# EAGLE design Addon-mapleCUx_HM-RFM69-RFM95-V10-016 (EAGLE 7.6.0)
MAPLE-CUx Large Version
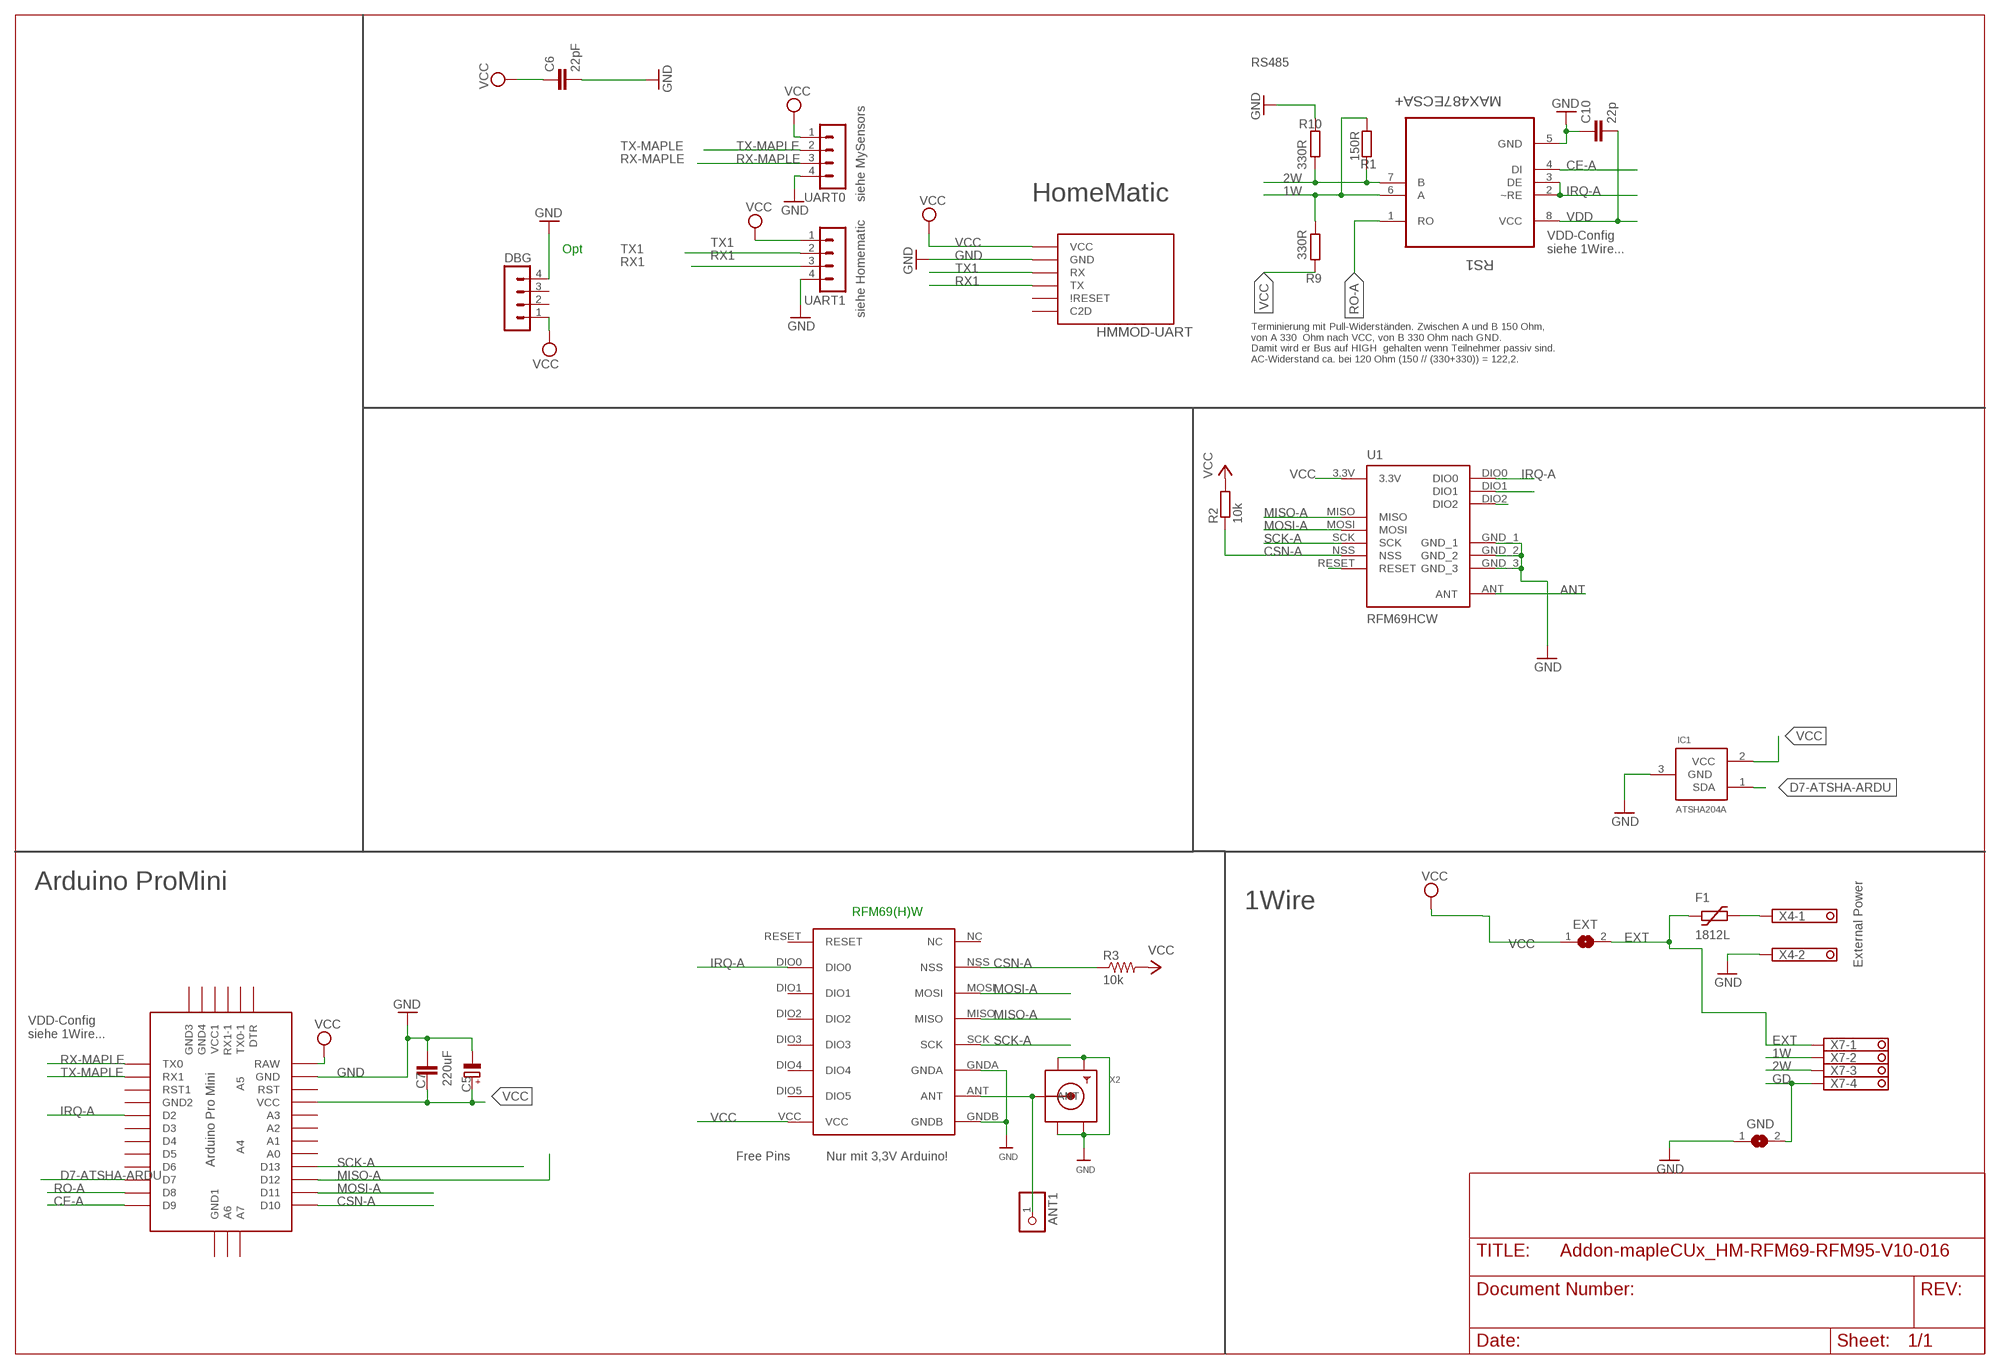
[diagram p0: schematic, sheet 1]

## Parts
ANT1  PINHD-1X1  [1X01]
C5  220uF  CPOL-EUE5-8.5  [E5-8,5]
C6  22pF  C-EUC0805  [C0805]
C7  C-EUC1812  [C1812]
C10  22p  C-EUC0805  [C0805]
DBG  MA04-1  [MA04-1]
EXT  SJ  [SJ]
F1  1812L  [1812L]
GND  SJ  [SJ]
HMMOD-UART  HM-MOD-UARTDIL  [HM-MOD-UART-DIL]
IC1  ATSHA204A  [SOT23]
R1  150R  R-EU_R0805  [R0805]
R2  10k  R-EU_M0805  [M0805]
R3  10k  RESISTOR0805-RES  [0805]
R9  330R  R-EU_R0805  [R0805]
R10  330R  R-EU_R0805  [R0805]
RFM69W  RFM69HW  [RFM]
RS1  MAX487ECSA+  [SOIC127P600X175-8N]
U1  RFM69HCW  [RFM69HCW-XXXS2]
U$2  ABK-PRO-MINI  [ABK-PRO-MINI]
UART0  MA04-1  [MA04-1]
UART1  MA04-1  [MA04-1]
X2  SMACONNECTOR_EDGE  [SMA_EDGELAUNCH]
X4  1751248  [1751248]
X7  1751264  [1751264]

## Nets
1W: R1.1 R9.2 RS1.6(A) X7.2
2W: R1.2 R10.1 RS1.7(B) X7.3
ANT: ANT1.1 RFM69W.ANT U1.ANT X2.P(ANT)
CE-A: RS1.4(DI) U$2.D9
CSN-A: R2.1 R3.1 RFM69W.NSS U1.NSS U$2.D10
D7-ATSHA-ARDU: IC1.1(SDA) U$2.D7
EXT [PWR]: EXT.2 F1.P$1 X7.1
GD [PWR]: GND.2 X7.4
GND [PWR]: C5.- C6.2 C7.1 C10.1 DBG.4 GND.1 HMMOD-UART.2(GND) IC1.3(GND) R10.2 RFM69W.GNDA RFM69W.GNDB RS1.5(GND) U1.GND_1 U1.GND_2 U1.GND_3 U$2.GND UART0.4 UART1.4 X2.GND@1(GND4) X2.GND@2(GND3) X2.GND@3(GND2) X2.GND@4(GND1) X4.2
IRQ-A: RFM69W.DIO0 RS1.2(~RE) RS1.3(DE) U1.DIO0 U$2.D2
MISO-A: RFM69W.MISO U1.MISO U$2.D12
MOSI-A: RFM69W.MOSI U1.MOSI U$2.D11
N$2: U1.RESET
N$14: U1.DIO2
N$15: U1.DIO1
N$45 [PWR]: F1.P$2 X4.1
RO-A: RS1.1(RO) U$2.D8
RX1: HMMOD-UART.5(TX) UART1.3
RX-MAPLE: U$2.TX0 UART0.3
SCK-A: RFM69W.SCK U1.SCK U$2.D13
TX1: HMMOD-UART.6(RX) UART1.2
TX-MAPLE: U$2.RX1 UART0.2
VCC [PWR]: C5.+ C6.1 C7.2 DBG.1 EXT.1 HMMOD-UART.1(VCC) IC1.2(VCC) R2.2 R3.2 R9.1 RFM69W.VCC U1.3.3V U$2.RAW U$2.VCC UART0.1 UART1.1
VDD [PWR]: C10.2 RS1.8(VCC)
Unconnected: DBG.2 DBG.3 HMMOD-UART.3(C2D) HMMOD-UART.4(\!RESET) RFM69W.DIO1 RFM69W.DIO2 RFM69W.DIO3 RFM69W.DIO4 RFM69W.DIO5 RFM69W.NC RFM69W.RESET U$2.A0 U$2.A1 U$2.A2 U$2.A3 U$2.A4 U$2.A5 U$2.A6 U$2.A7 U$2.D3 U$2.D4 U$2.D5 U$2.D6 U$2.DTR U$2.GND1(GND2) U$2.GND2(GND3) U$2.GND3(GND4) U$2.GND4(GND1) U$2.RST U$2.RST1 U$2.RX1-1 U$2.TX0-1 U$2.VCC1

## Notes on the sheet
- RS485
- siehe MySensors | HomeMatic
- Opt
- VDD-Config
  siehe 1Wire...
- siehe Homematic
- Terminierung mit Pull-Widerständen. Zwischen A und B 150 Ohm,
  von A 330  Ohm nach VCC, von B 330 Ohm nach GND. 
  Damit wird er Bus auf HIGH  gehalten wenn Teilnehmer passiv sind.
  AC-Widerstand ca. bei 120 Ohm (150 // (330+330)) = 122,2.
- Arduino ProMini
- 1Wire
- RFM69(H)W
- External Power
- VDD-Config
  siehe 1Wire...
- Free Pins | Nur mit 3,3V Arduino!

## Library data of the parts
ANT1 = pinhead:PINHD-1X1: PIN HEADER
C5 = rcl:CPOL-EU: POLARIZED CAPACITOR, European symbol
C6 C7 C10 = rcl:C-EU: CAPACITOR, European symbol
DBG UART0 UART1 = con-lstb:MA04-1: PIN HEADER; OC_FARNELL: unknown; OC_NEWARK: unknown
EXT GND = jumper:SJ: SMD solder JUMPER
F1 = ptc-littlefuse:1812L
HMMOD-UART = wireless:HM-MOD-UART: eQ3 HM-MOD-UART-AW-SH2 wireless module for 868 MHz. DIL version for mounting with pin header (antenna upwards) and SMD variant available (antenna downwards).
IC1 = Sensor:ATSHA204A
R1 R2 R9 R10 = rcl:R-EU_: RESISTOR, European symbol
R3 = doug:RESISTOR: Resistor Basic schematic elements and footprints for 0603, 1206, and PTH resistors.
RFM69W = hoperf:RFM69HW
RS1 = Maxim_By_element14_Batch_1:MAX487ECSA+: Low-Power, Slew-Rate-Limited RS-485/RS-422 Transceivers; MPN: MAX487ECSA+; OC_FARNELL: 9724532; OC_NEWARK: 68K4803; PACKAGE: SOIC-8; SUPPLIER: Maxim
U1 = doug:RFM69H
U$2 = Arduino-clone:ABK-PRO-MINI: ABK Pro-Mini Arduino Clone
X2 = adafruit:SMACONNECTOR: SMA Connector 90° DIP SMA Connector, 50 Ohm (4UConnector: 07259)
X4 = con-phoenix-350:1751248: MKDS 1/ 2-3,5 Printklemme Nennstrom: 10 A Bemessungsspannung: 160 V Raster: 3,5 mm Polzahl: 2 Montageart: Löten Anschlussart: Schraubanschluss Anschlussrichtung vom Leiter zur Platine: 0° Source: http://eshop.phoenixcontact.com .. 1751248.pdf; OC_FARNELL: unknown; OC_NEWARK: unknown
X7 = con-phoenix-350:1751264: MKDS 1/ 4-3,5 Printklemme Nennstrom: 10 A Bemessungsspannung: 160 V Raster: 3,5 mm Polzahl: 4 Montageart: Löten Anschlussart: Schraubanschluss Anschlussrichtung vom Leiter zur Platine: 0° Source: http://eshop.phoenixcontact.com .. 1751264.pdf; MPN: 1751264; OC_FARNELL: unknown; OC_NEWARK: 10R0934

## Net classes
0 default: width 0.305 mm
1 PWR: width 0.457 mm

## Board
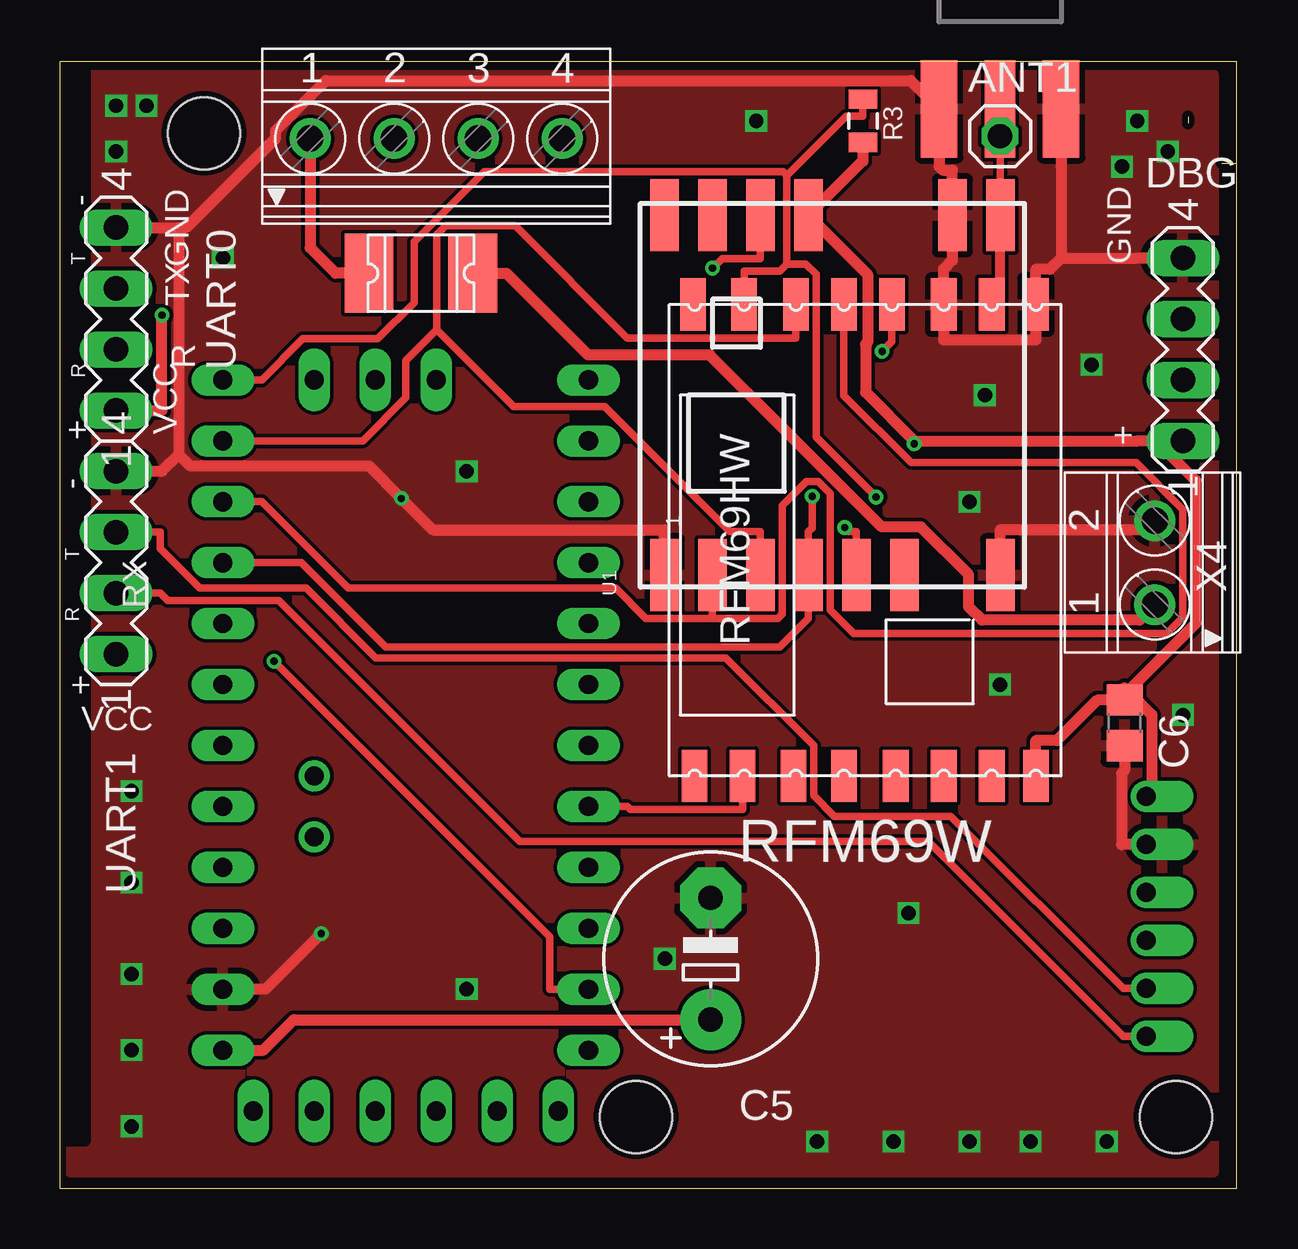
[diagram p1: board, top side]
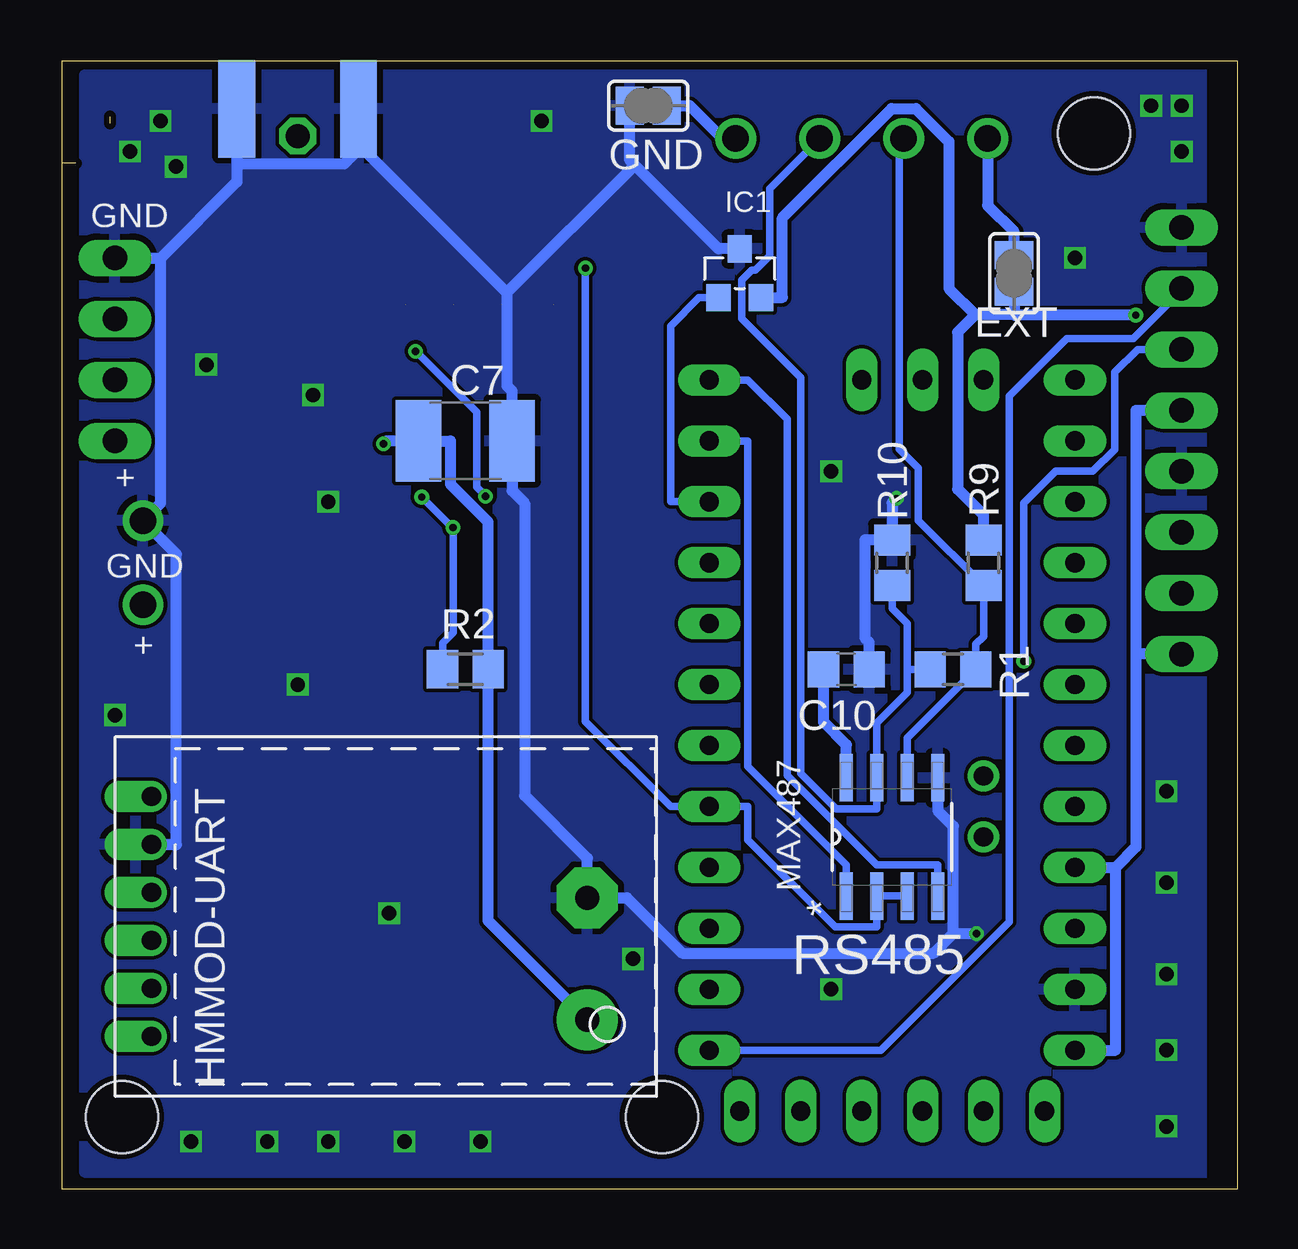
[diagram p2: board, bottom side, seen from below]

Size 49 x 47 mm. Coordinates in mm from the lower left corner, seen from the top.
Outline: 49,47 49,46.24
Outline: 47,44.7 47,44.41
Outline: 48.41,42.75 49,42.75
Outline: 49,47 0,47 0,0 49,0 49,42.75
Outline: 49,47 49,42.75
Copper layers (1*16): Top 0.035mm / dielectric 1.5mm / Bottom 0.035mm
Design rules "SeeedStudio_2layer_DRU_no_angle_20140221": minimum track width 6mil, minimum drill 12mil, track to track 6mil, track to pad 6mil, pad to pad 6mil, via to via 6mil, smd to smd 0mil, copper to edge 10mil, drill to drill 10mil, minimum pad ring 10mil, minimum via ring 6mil, stop-mask expansion 2mil, vias tented up to drill 100mil, thermal gap 10mil
Holes 3 mm at 6,44 24,3 46.5,3
tRestrict: area 0.4,2 to 1.1,47.1
bRestrict: area 0.4,0.7 to 1.1,46.4

### Footprints (pad centres in the part's own frame; a part is rotated, then mirrored left to right if it is on the bottom)
1X01 = drill 1.016 octagon: 1 0,0
E5-8,5 = drill 1.016 pad 2.54: + -2.54,0 | drill 1.016 pad 2.54 octagon: - 2.54,0
C0805 = smd 1.3 x 1.5: 1 -0.95,0; 2 0.95,0
C1812 = smd 1.9 x 3.4: 1 -1.95,0; 2 1.95,0
MA04-1 = drill 1.016 long: 1 -3.81,0; 2 -1.27,0; 3 1.27,0; 4 3.81,0
SJ = smd 1.168 x 1.6: 1 -0.762,0; 2 0.762,0
1812L = smd 2.03 x 3.3: P$1 -2.16,0; P$2 2.16,0
HM-MOD-UART-DIL = drill 0.8 offset: 1 0,12; 2 0,10; 3 0,8; 4 0,6; 5 0,4; 6 0,2
SOT23 = smd 1.016 x 1.143: 1 -0.889,-1.016; 2 0.889,-1.016; 3 0,1.016
R0805 = smd 1.3 x 1.5: 1 -0.95,0; 2 0.95,0
M0805 = smd 1.3 x 1.6: 1 -0.95,0; 2 0.95,0
0805 = smd 0.8 x 1.2: 1 -0.9,0; 2 0.9,0
RFM = smd 2.184 x 1.067: ANT 19.651,2.889; DIO0 0,13.27; DIO1 0,11.143; DIO2 0,9.047; DIO3 0,6.889; DIO4 0,4.889; DIO5 0,2.889; GNDA 19.651,4.889; GNDB 19.651,1.048; MISO 19.651,9.047; MOSI 19.651,11.047; NC 19.651,15.334; NSS 19.651,13.206; RESET 0,15.27; SCK 19.651,7.048; VCC 0,1.048
SOIC127P600X175-8N = smd 1.981 x 0.533: 1 -2.464,1.905; 2 -2.464,0.635; 3 -2.464,-0.635; 4 -2.464,-1.905; 5 2.464,-1.905; 6 2.464,-0.635; 7 2.464,0.635; 8 2.464,1.905
RFM69HCW-XXXS2 = smd 3 x 1.2: 3.3V 7.5,1; ANT 7.5,-7; DIO0 7.5,3; DIO1 7.5,5; DIO2 7.5,7; GND_1 7.5,-5; GND_2 -7.5,-7; GND_3 -7.5,7; MISO -7.5,5; MOSI -7.5,3; NSS -7.5,-1; RESET -7.5,-3; SCK -7.5,1
ABK-PRO-MINI = drill 0.8 long: A0 10.16,-3.81; A1 10.16,-6.35; A2 10.16,-8.89; A3 10.16,-11.43; A6 3.81,-21.59; A7 6.35,-21.59; D2 -5.08,-3.81; D3 -5.08,-6.35; D4 -5.08,-8.89; D5 -5.08,-11.43; D6 -5.08,-13.97; D7 -5.08,-16.51; D8 -5.08,-19.05; D9 -5.08,-21.59; D10 10.16,-21.59; D11 10.16,-19.05; D12 10.16,-16.51; D13 10.16,-13.97; DTR 8.89,8.89; GND 10.16,3.81; GND1 -5.08,-1.27; GND2 -3.81,8.89; GND3 -1.27,8.89; GND4 1.27,-21.59; RAW 10.16,6.35; RST 10.16,1.27; RST1 -5.08,1.27; RX1 -5.08,3.81; RX1-1 3.81,8.89; TX0 -5.08,6.35; TX0-1 6.35,8.89; VCC 10.16,-1.27; VCC1 1.27,8.89 | drill 0.8: A4 6.35,-5.08; A5 6.35,-2.54
SMA_EDGELAUNCH = smd 4.064 x 1.524: GND@1 2.032,-2.54; GND@2 2.032,2.54 | smd 4.064 x 1.524 bottom: GND@3 2.032,2.54; GND@4 2.032,-2.54 | smd 4.064 x 1.27: P 2.032,0
1751248 = drill 1.1 pad 1.7: 1 -1.75,-0.1; 2 1.75,-0.1
1751264 = drill 1.1 pad 1.7: 1 -5.25,-0.1; 2 -1.75,-0.1; 3 1.75,-0.1; 4 5.25,-0.1

### Placement (x,y rotation side)
ANT1  39.17,43.88 0 top
C5  27.11,9.59 90 top
C6  44.36,19.43 270 top
C7  32.19,31.18 180 bottom
C10  16.31,21.66 180 bottom
DBG  46.79,34.99 90 top
EXT  9.33,38.16 90 bottom
F1  15.04,38.16 0 top
GND  24.56,45.15 0 bottom
HMMOD-UART  45.27,4.35 0 bottom
IC1  20.75,38.16 0 bottom
R1  11.87,21.66 180 bottom
R2  32.19,21.66 0 bottom
R3  33.45,44.52 270 top
R9  10.59,26.1 270 bottom
R10  14.41,26.1 90 bottom
RFM69W  41.71,17.21 90 top
RS1  14.41,14.67 90 bottom
U1  32.19,33.09 90 top
U$2  16.94,12.13 180 top
UART0  2.34,36.26 90 top
UART1  2.34,26.1 90 top
X2  39.17,47.05 270 top
X4  45.52,26.1 90 top
X7  15.67,43.88 0 top

### Tracks (layer width: path | path; a pad name or v marks a point on that pad's centre or on a via)
1W
  Bottom 0.305: RS1.6 13.77,18.8 R1.1 10.91,22.71 10.59,23.03 R9.2 13.31,27.87 13.31,30.04 14.11,30.84 14.11,43.6 X7.2
2W
  Bottom 0.305: R10.1 14.41,24.2 13.77,23.56 13.77,21.66 | R1.2 13.77,21.66 | 13.77,21.66 13.77,20.7 15.04,19.43 RS1.7 15.04,16.49 15.04,15.84 16.74,15.84 18.22,17.32 18.22,33.81 20.68,36.27 20.68,37.87 20.24,38.3 20.1,38.3 19.51,38.89 19.51,41.69 X7.3
ANT
  Top 0.305: X2.P ANT1.1 39.17,42.81 39.19,42.8 U1.ANT
  Top 0.406: RFM69W.ANT 39.19,36.86 U1.ANT
CE-A
  Bottom 0.305: RS1.4 12.5,13.5 15.05,13.5 18.78,17.23 18.78,32.09 20.41,33.72 U$2.D9
CSN-A  (via drill 0.3 pad 0.61)  (1 unrouted)
  Top 0.305: 30.28,38.55 29.99,38.26 28.5,38.26 RFM69W.NSS | v34,28.84 31.5,31.34 31.5,38.13 31.08,38.55 30.28,38.55 | 30.28,38.55 30.28,42.24 | v32.7,27.56 32.87,27.39 33.19,27.39 U1.NSS | 30.28,42.24 32.75,44.71 33.45,44.71 R3.1 | 30.28,42.24 30.13,42.39 17.67,42.39 14.77,39.48 14.77,36.95 13.25,35.43 10.11,35.43 8.4,33.72 U$2.D10
  Bottom 0.305: v34,28.84 32.73,27.56 v32.7,27.56 32.7,23.2 33.14,22.76 R2.1
D7-ATSHA-ARDU
  Bottom 0.305: IC1.1 22.46,37.15 23.64,35.97 23.64,28.64 U$2.D7
EXT
  Top 0.457: F1.P$1 11.48,38.16 10.42,39.22 X7.1
  Bottom 0.457: EXT.2 9.33,39.89 10.42,40.99 X7.1
GD
  Bottom 0.457: GND.2 22.84,45.15 21.47,43.78 X7.4
GND  (via drill 0.3 pad 0.61, 0.6)
  Top 0.457: HMMOD-UART.2 44.23,14.35 44.23,17.32 44.36,17.44 C6.2 | 4.94,30.61 5.41,30.15 12.85,30.15 v14.22,28.78 15.53,27.47 25.19,27.47 U1.GND_3 | 4.94,30.61 4.24,29.91 UART1.4 | 4.94,40.07 4.94,30.61 | 4.94,40.07 5.25,40.07 8.99,43.8 8.99,44.1 11.08,46.2 35.46,46.2 X2.GND@1 36.63,42.61 36.77,42.47 37.19,42.47 U1.GND_1 37.19,38.7 36.82,38.34 RFM69W.GNDA 36.82,35.39 40.66,35.39 RFM69W.GNDB 40.66,38.34 41.25,38.34 41.71,38.8 | UART0.4 4.94,40.07 | U1.GND_2 39.19,27.47 45.24,27.47 X4.2 | v10.88,10.64 8.56,8.32 U$2.GND | 41.71,38.8 41.71,42.61 X2.GND@2 | 41.71,38.8 44.89,38.8 DBG.4
  Bottom 0.457: HMMOD-UART.2 44.23,14.35 44.23,26.46 X4.2 44.89,28.59 44.89,38.8 | v14.22,28.78 14.41,28.59 R10.2 15.54,27.05 15.54,22.96 15.36,22.79 C10.1 | 25.13,42.67 25.33,42.86 GND.1 | 25.13,42.67 21.64,39.18 IC1.3 | 30.45,37.35 25.13,42.67 | 30.45,37.35 30.45,33.48 30.23,33.26 30.23,32.22 C7.1 30.23,29.1 29.72,28.58 29.72,16.39 27.11,13.78 C5.- 25.45,12.13 23.15,9.82 12.67,9.82 11.85,10.64 | 36.63,43.34 36.44,43.34 30.45,37.35 | 11.85,10.64 11.85,15.11 12.5,15.76 RS1.5 | 11.85,10.64 v10.88,10.64 | 41.71,42.73 37.24,42.73 36.63,43.34 | 41.71,42.73 41.71,41.98 44.89,38.8 | X2.GND@1 36.63,43.34 | DBG.4 44.89,38.8 | X2.GND@2 41.71,42.73
  other vias: 2.98,2.61 2.98,5.78 2.98,8.95 2.98,12.77 2.98,16.57 2.34,43.24 2.34,45.15 3.61,45.15 6.78,38.8 16.94,29.91 16.94,8.32 25.2,9.59 31.55,1.97 43.61,1.97 40.44,1.97 37.9,1.97 34.72,1.97 35.36,11.5 39.17,21.02 37.9,28.64 38.53,33.09 29.01,44.52 44.89,44.52 46.16,43.24 44.25,42.61 42.98,34.35 46.79,19.75
  pour Top: 0.44,0.7 0.44,46.42 48.06,46.42 48.06,0.7
  pour Bottom: 0.44,0.7 0.44,46.42 48.06,46.42 48.06,0.7
IRQ-A  (via drill 0.3 pad 0.61)
  Top 0.305: U1.DIO0 29.19,38.78 27.59,38.78 v27.18,38.38 | RFM69W.DIO0 28.44,15.81 23.77,15.81 23.64,15.94 U$2.D2
  Bottom 0.305: v27.18,38.38 27.18,19.48 23.64,15.94 U$2.D2 20.41,15.94 20.41,14.55 16.78,10.91 15.04,10.91 RS1.2 RS1.3
MISO-A  (1 unrouted)
  Top 0.305: RFM69W.MISO 32.66,33.06 35.46,30.27 44.84,30.27 46.78,28.32 46.78,23.81 46.12,23.15 33.07,23.15 32.09,24.13 32.09,28.99 31.59,29.49 31.1,29.49 30.09,28.48 30.09,23.96 29.91,23.78 27.19,23.78 | U$2.D12 8.4,28.64 12,25.03 23.15,25.03 24.41,23.78 27.19,23.78 | 27.19,23.78 27.19,23.99 U1.MISO
MOSI-A  (1 unrouted)
  Top 0.305: U1.MOSI 29.19,27.39 27.91,27.39 22.69,32.61 18.9,32.61 15.7,35.81 | 15.7,35.81 15.7,35.82 15.7,39.77 16.07,40.14 18.96,40.14 23.63,35.46 30.66,35.46 RFM69W.MOSI | 15.7,35.81 14.41,34.52 14.41,32.98 12.61,31.18 8.4,31.18 U$2.D11
N$45
  Top 0.457: F1.P$2 18.6,38.16 22.01,34.76 27.08,34.76 34.24,27.59 35.87,27.59 37.86,25.6 37.86,24.26 38.42,23.7 44.97,23.7 X4.1
RO-A
  Bottom 0.305: RS1.1 16.31,13.5 20.41,17.6 20.41,31.18 U$2.D8
RX1
  Top 0.305: HMMOD-UART.5 44.31,8.35 37.12,15.53 32.27,15.53 31.41,16.4 31.41,18.48 27.75,22.13 13.15,22.13 10.25,25.03 5.82,25.03 4.17,26.68 4.17,27.37 UART1.3
RX-MAPLE
  Bottom 0.305: UART0.3 2.34,37.47 4.36,35.44 7.12,35.44 9.53,33.03 9.53,11.14 14.89,5.78 20.41,5.78 U$2.TX0
SCK-A  (via drill 0.3 pad 0.61)  (1 unrouted)
  Top 0.305: v34.26,34.91 34.66,35.32 RFM69W.SCK | v31.34,28.87 31.34,27.55 31.19,27.39 U1.SCK 31.19,24.68 31.19,23.78 30,22.59 13.57,22.59 10.06,26.1 U$2.D13
  Bottom 0.305: v31.34,28.87 31.72,29.25 31.72,32.38 v34.26,34.91
TX1
  Top 0.305: HMMOD-UART.6 44.31,6.35 36.18,14.47 19.16,14.47 9.11,24.52 4.48,24.52 4.17,24.83 UART1.2
TX-MAPLE  (via drill 0.3 pad 0.61)
  Top 0.305: U$2.RX1 20.41,8.32 20.41,10.49 v8.92,21.99
  Bottom 0.305: UART0.2 4.17,34.99 5.12,34.03 5.12,30.82 6.04,29.91 7.59,29.91 8.92,28.58 v8.92,21.99
VCC  (via drill 0.3 pad 0.61)
  Top 0.457: 44.5,20.75 45.49,19.76 45.49,16.58 HMMOD-UART.1 | 44.5,20.75 44.36,20.89 C6.1 43.23,20.38 41.54,18.68 40.66,18.68 RFM69W.VCC | 44.5,20.75 47.33,23.58 47.33,29.53 45.68,31.18 | 45.68,31.18 44.89,31.18 35.59,31.18 | DBG.1 45.68,31.18 | 35.59,31.18 v35.59,31.05 | 35.59,31.18 33.57,33.2 33.57,35.2 33.66,35.28 33.66,38.12 U1.3.3V 33.43,42.83 33.45,42.83 R3.2 | UART0.1 4.24,32.45 v4.24,36.41 v4.25,36.42 | U$2.RAW 8.47,5.78 9.74,7.05 C5.+
  Bottom 0.457: C5.+ 31.23,11.18 R2.2 31.23,27.8 32.8,29.37 32.8,31.18 C7.2 35.47,31.18 v35.59,31.05 | 5.1,13.4 5.1,5.78 U$2.RAW | 4.24,22.29 4.24,14.25 5.1,13.4 | U$2.VCC 5.1,13.4 | 4.24,22.29 4.24,32.45 UART0.1 | IC1.2 18.98,37.15 18.98,40.48 14.43,45.03 13.41,45.03 12.04,43.65 12.04,37.53 10.95,36.44 | 10.95,36.44 11.68,35.71 11.68,29.16 10.59,28.08 R9.1 | 9.33,36.44 10.95,36.44 | EXT.1 9.33,36.44 | v4.25,36.42 9.31,36.42 9.33,36.44 | UART1.1 4.24,22.29
VDD
  Bottom 0.457: RS1.8 16.31,18.51 17.26,19.46 C10.2

### Text on the board
tNames: GND | - | T | GND | TX | R | R | + | VCC | + | - | T | R | RX | + | VCC
bNames: GND | + | GND | + | MAX487 | RS485